# Altium schematic sheet fiber.SCHDOC
size B
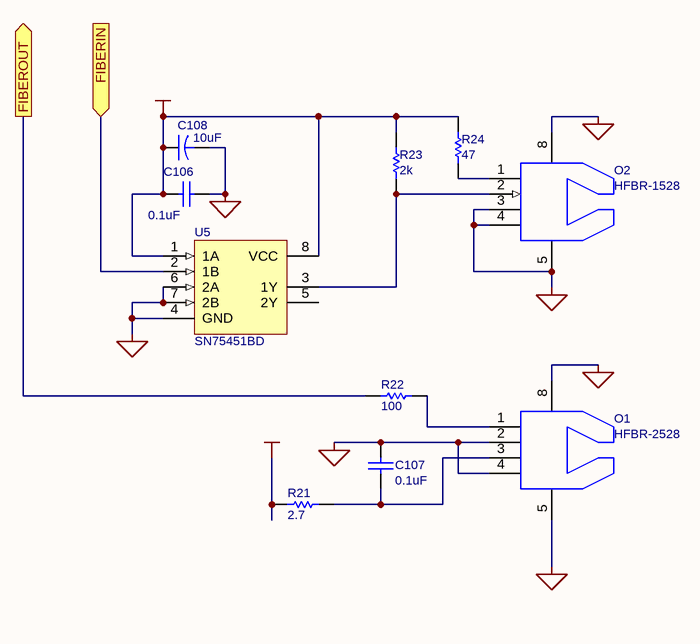
[diagram p0: fiber.SCHDOC]

## Parts
C106  value 0.1uF  [CC1005-0402]  (hidden comment: Cap)
C107  value 0.1uF  [CC1005-0402]  (hidden comment: Cap)
C108  value 10uF  [TC3528-1411]
O1  HFBR-2528  [HPVL]
O2  HFBR-1528  [HPVL]
R21  value 2.7  [CR1608-0603]  (hidden comment: Res1)
R22  value 100  [CR1608-0603]  (hidden comment: Res1)
R23  value 2k  [CR1608-0603]  (hidden comment: Res1)
R24  value 47  [CR1608-0603]  (hidden comment: Res1)
U5  SN75451BD  [SO-G8/E2.5]

## Ports
FIBERIN (in), FIBEROUT (out)

## Nets
+5VCC: C106.1 C108.1 R21.1 R23.2 R24.2 U5.1(1A) U5.8(VCC)
GND: C106.2 C107.2 C108.2 O1.2 O1.4 O1.5 O1.8 O2.3 O2.4 O2.5 O2.8 U5.4(GND) U5.6(2A) U5.7(2B)
FIBERIN: U5.2(1B) ; port FIBERIN
FIBEROUT: R22.1 ; port FIBEROUT
NetC107_1: C107.1 O1.3 R21.2
NetO1_1: O1.1 R22.2
NetO2_1: O2.1 R24.1
NetO2_2: O2.2 R23.1 U5.3(1Y)

Not connected (* = marked no-connect by the designer): U5 5(2Y)

## Notes on the sheet
- Title:
- Engineer:
- Date:
- Revision:
- Sheet
- of
- File:

## Library data of the parts
C106 C107 = Cap: Capacitor; Manufacturer: Generic Components; Class I: Passive; Published: 8-Jun-2000; Revision: July-2002: Re-released for DXP Platform.; Publisher: Altium Limited; Class II: Capacitor
C108 = Cap2: Capacitor; Manufacturer: Generic Components; Class I: Passive; Published: 23-Sep-2002; Publisher: Altium Limited; Class II: Capacitor
O1 = HFBR-2528: Low-cost fiber receiver
O2 = HFBR-1528: Low-cost fiber transmitter
R21-R24 = Res1: Resistor; Manufacturer: Generic Components; Class I: Passive; Published: 8-Jun-2000; Revision: July-2002: Re-released for DXP Platform.; Publisher: Altium Limited; Class II: Resistor
U5 = SN75451BD: Dual Peripheral Driver; Manufacturer: Texas Instruments; Package Information: Latest Revision: Jan-1998; Class I: Interface; Published: 15-May-2002; Datasheet: 1991 Interface Circuits Data Book (May-1990); Package Reference: D008; Publisher: Altium Limited; Class II: Peripheral Driver